# EAGLE schematic rn_mk2 (EAGLE 7.5.0)
Rusia Neagra MKII
TITLE: Rusia Neagra MKII

## Sheet 1 of 2: Rusia Neagra MKII main point to point
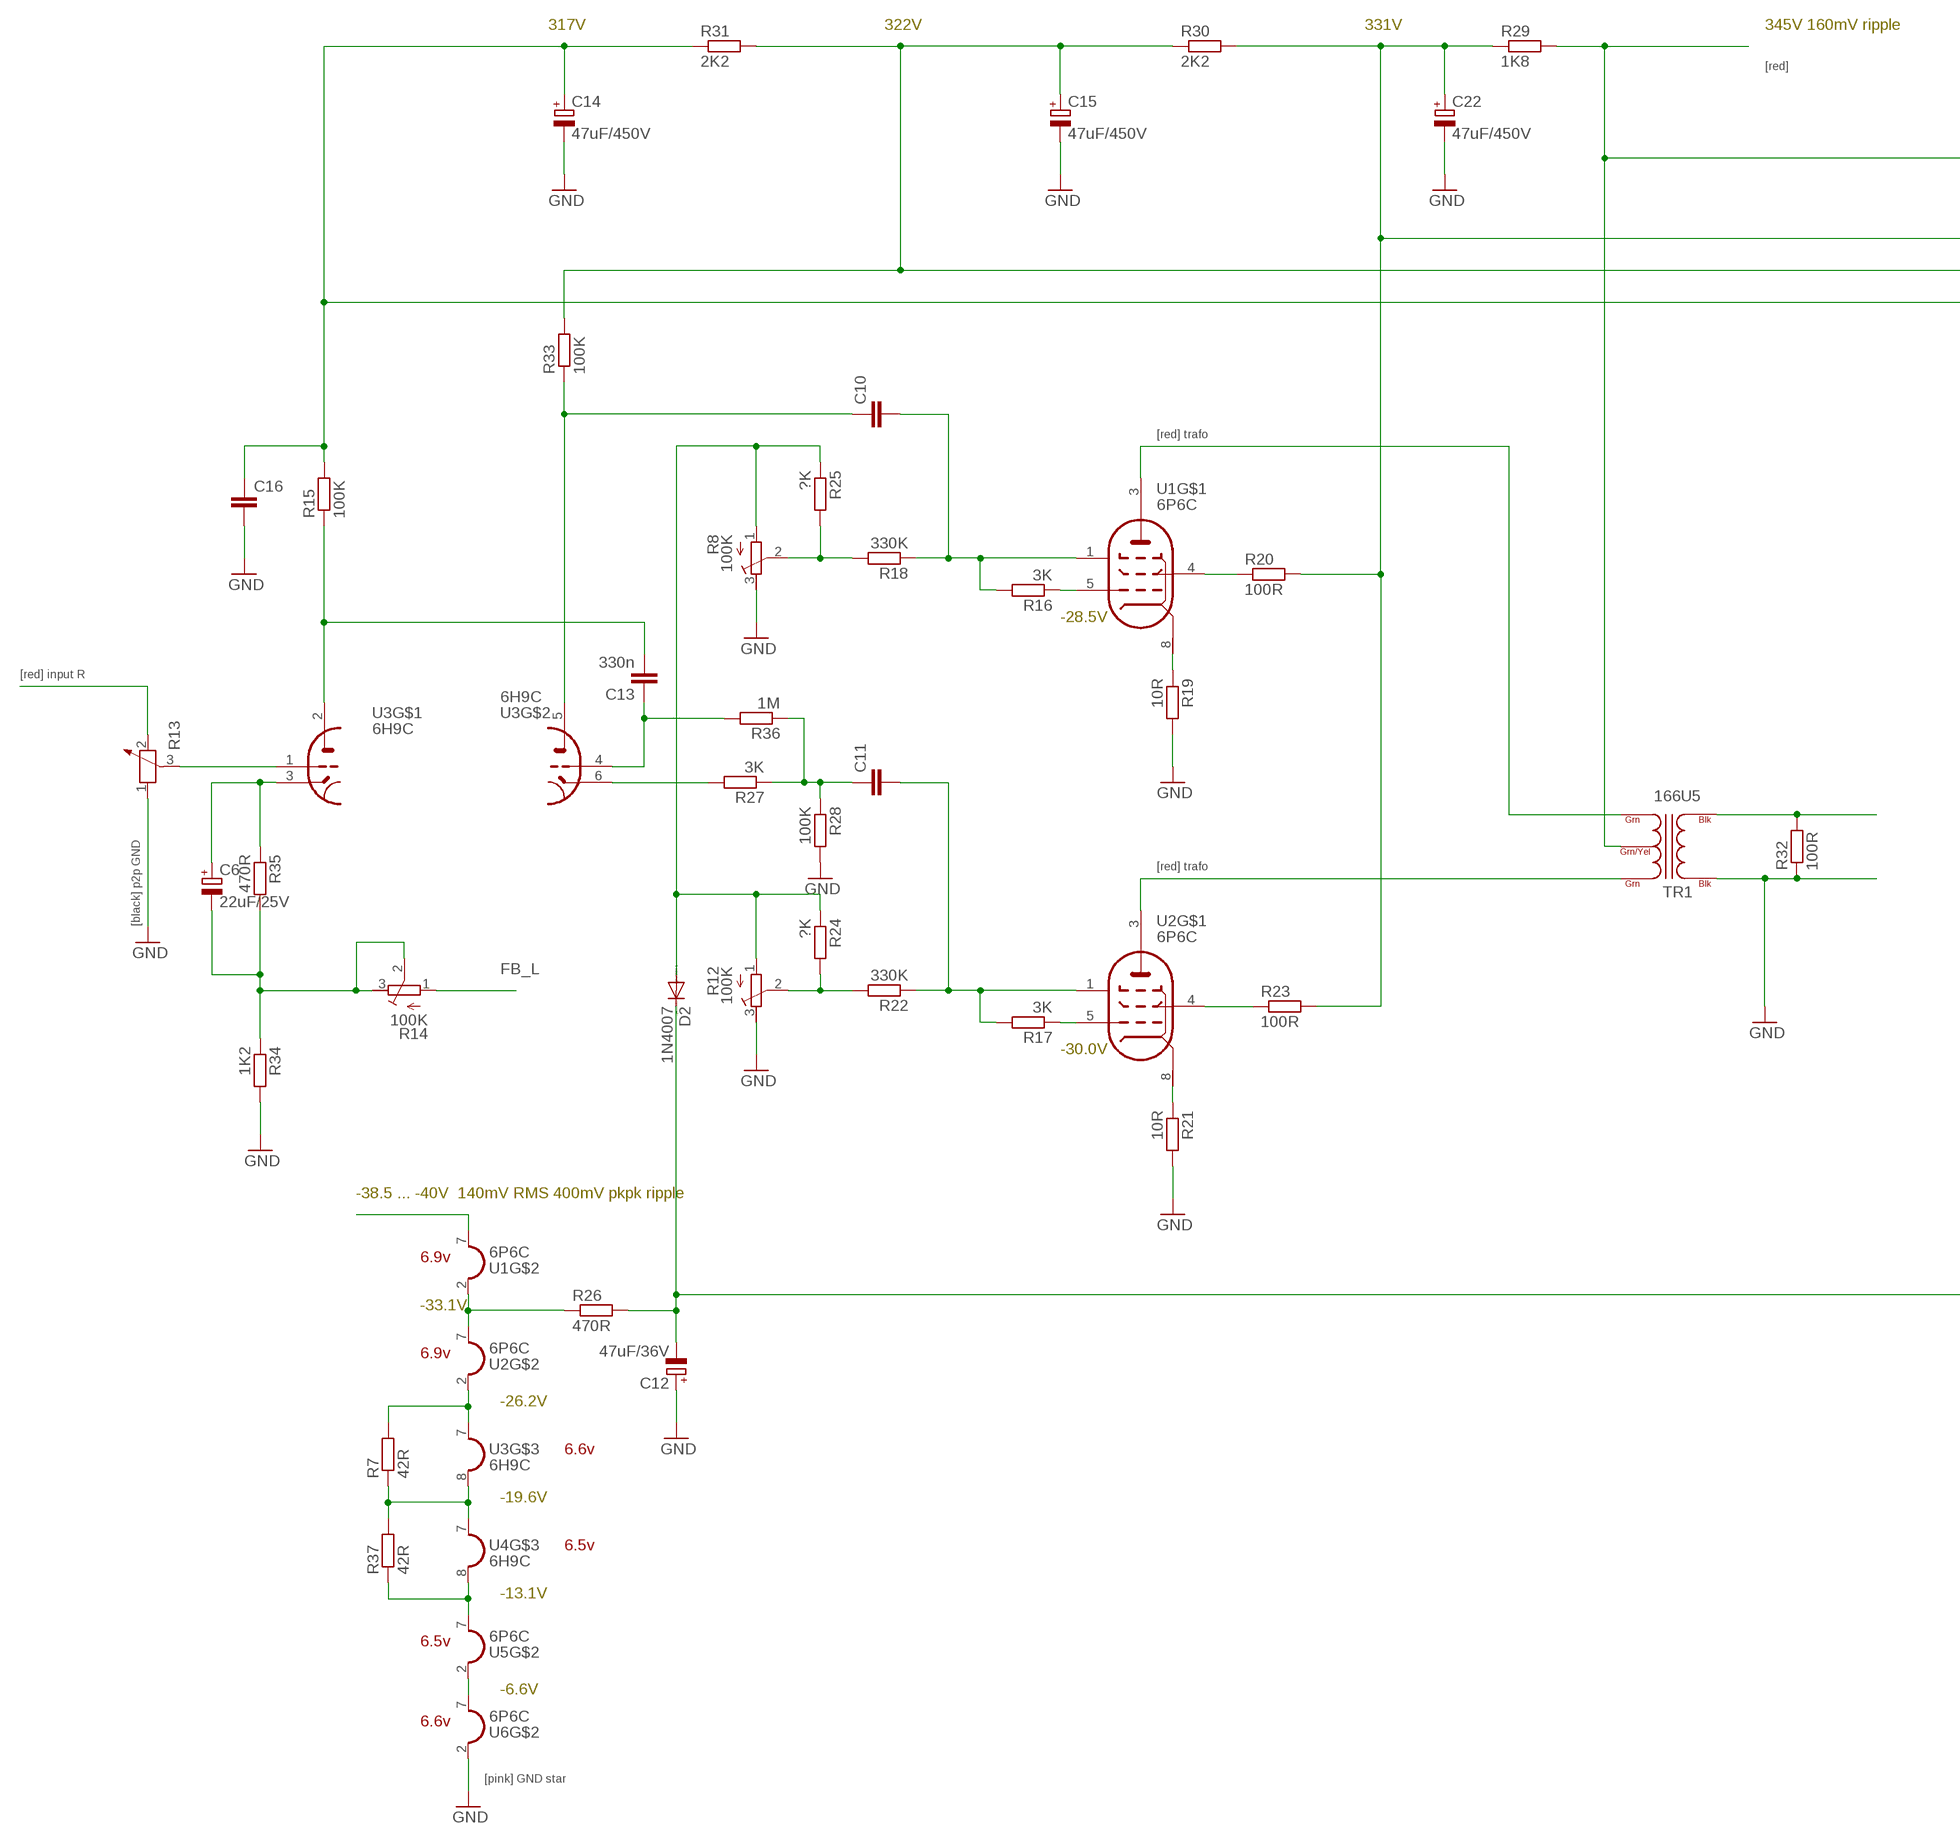
[diagram p0: schematic, sheet 1, part 1 of 2]
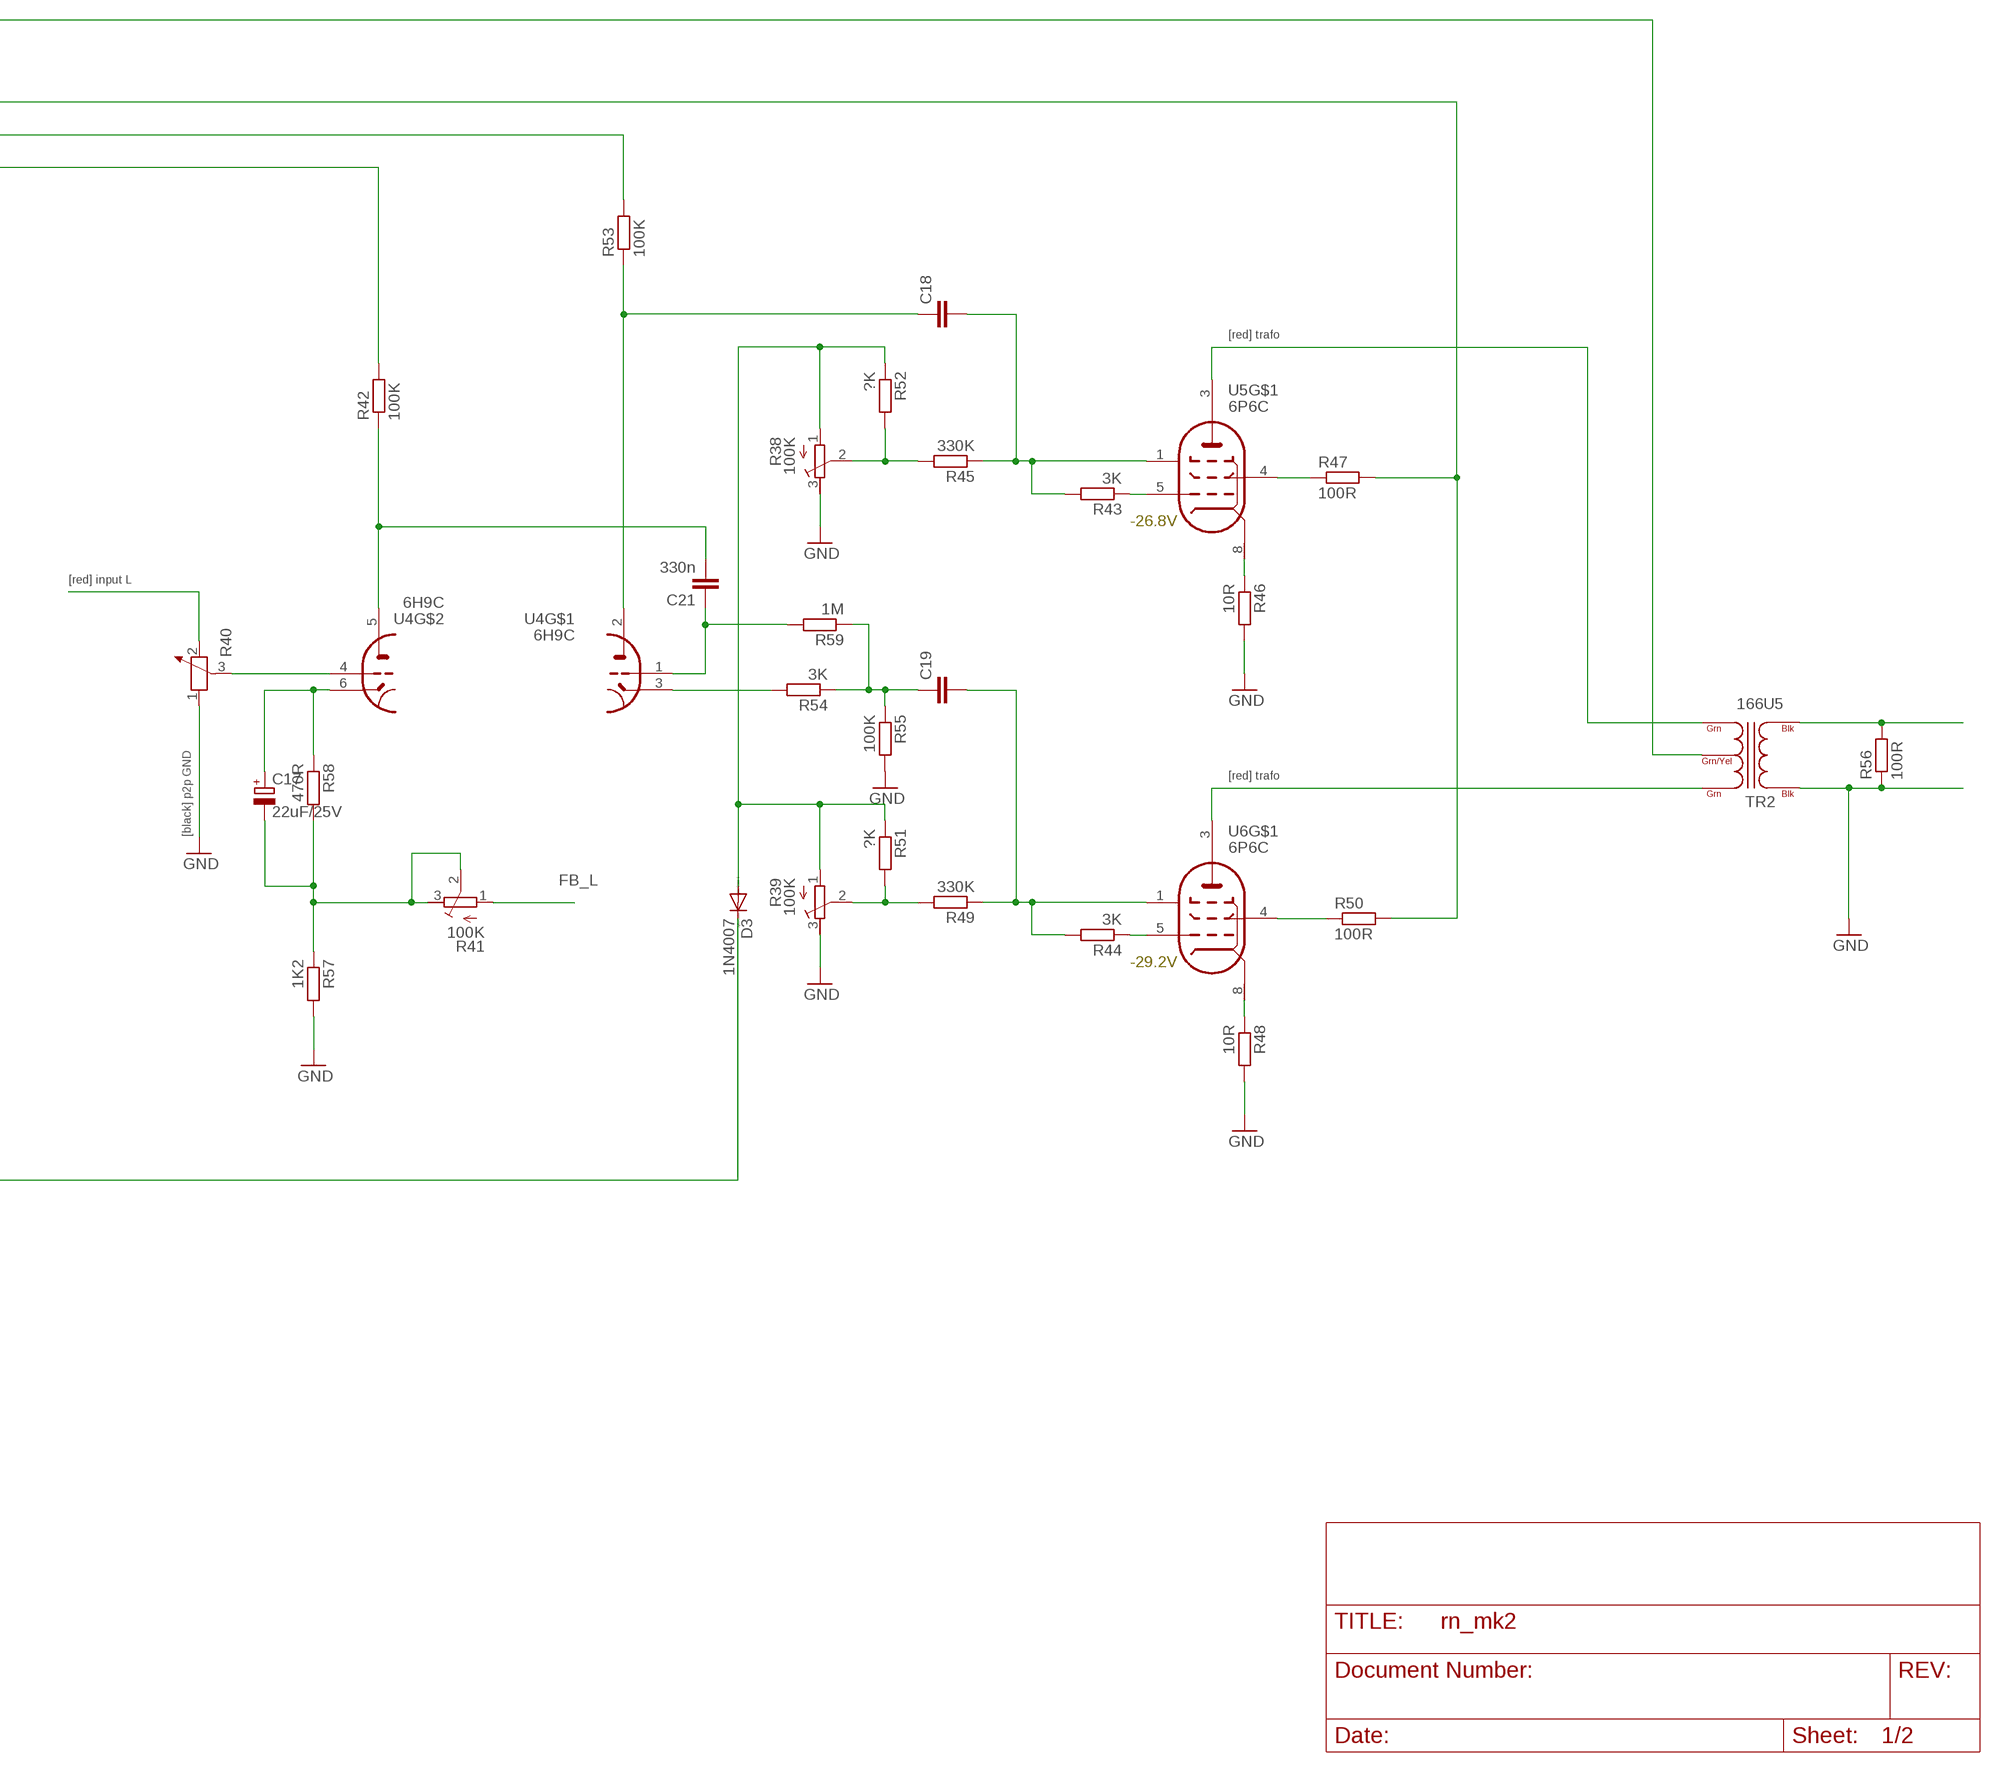
[diagram p1: schematic, sheet 1, part 2 of 2]

### Parts
C6  22uF/25V  CPOL-EUE5-5  [E5-5]
C10  C-EU150-054X183  [C150-054X183]
C11  C-EU150-054X183  [C150-054X183]
C12  47uF/36V  CPOL-EUE5-5  [E5-5]
C13  330n  C-EU150-054X183  [C150-054X183]
C14  47uF/450V  CPOL-EUE5-5  [E5-5]
C15  47uF/450V  CPOL-EUE5-5  [E5-5]
C16  C-EU150-054X183  [C150-054X183]
C17  22uF/25V  CPOL-EUE5-5  [E5-5]
C18  C-EU150-054X183  [C150-054X183]
C19  C-EU150-054X183  [C150-054X183]
C21  330n  C-EU150-054X183  [C150-054X183]
C22  47uF/450V  CPOL-EUE5-5  [E5-5]
D2  1N4007  1N4004  [DO41-10]
D3  1N4007  1N4004  [DO41-10]
R7  42R  R-EU_0414/15  [0414/15]
R8  100K  R-TRIMM64Y  [RTRIM64Y]
R12  100K  R-TRIMM64Y  [RTRIM64Y]
R13  POTENTIOMETER_PT-10  [PT-10]
R14  100K  R-TRIMM64Y  [RTRIM64Y]
R15  100K  R-EU_0414/15  [0414/15]
R16  3K  R-EU_0414/15  [0414/15]
R17  3K  R-EU_0414/15  [0414/15]
R18  330K  R-EU_0414/15  [0414/15]
R19  10R  R-EU_0414/15  [0414/15]
R20  100R  R-EU_0414/15  [0414/15]
R21  10R  R-EU_0414/15  [0414/15]
R22  330K  R-EU_0414/15  [0414/15]
R23  100R  R-EU_0414/15  [0414/15]
R24  ?K  R-EU_0414/15  [0414/15]
R25  ?K  R-EU_0414/15  [0414/15]
R26  470R  R-EU_0922/22  [0922/22]
R27  3K  R-EU_0414/15  [0414/15]
R28  100K  R-EU_0414/15  [0414/15]
R29  1K8  R-EU_0414/15  [0414/15]
R30  2K2  R-EU_0414/15  [0414/15]
R31  2K2  R-EU_0414/15  [0414/15]
R32  100R  R-EU_0414/15  [0414/15]
R33  100K  R-EU_0414/15  [0414/15]
R34  1K2  R-EU_0414/15  [0414/15]
R35  470R  R-EU_0414/15  [0414/15]
R36  1M  R-EU_0414/15  [0414/15]
R37  42R  R-EU_0414/15  [0414/15]
R38  100K  R-TRIMM64Y  [RTRIM64Y]
R39  100K  R-TRIMM64Y  [RTRIM64Y]
R40  POTENTIOMETER_PT-10  [PT-10]
R41  100K  R-TRIMM64Y  [RTRIM64Y]
R42  100K  R-EU_0414/15  [0414/15]
R43  3K  R-EU_0414/15  [0414/15]
R44  3K  R-EU_0414/15  [0414/15]
R45  330K  R-EU_0414/15  [0414/15]
R46  10R  R-EU_0414/15  [0414/15]
R47  100R  R-EU_0414/15  [0414/15]
R48  10R  R-EU_0414/15  [0414/15]
R49  330K  R-EU_0414/15  [0414/15]
R50  100R  R-EU_0414/15  [0414/15]
R51  ?K  R-EU_0414/15  [0414/15]
R52  ?K  R-EU_0414/15  [0414/15]
R53  100K  R-EU_0414/15  [0414/15]
R54  3K  R-EU_0414/15  [0414/15]
R55  100K  R-EU_0414/15  [0414/15]
R56  100R  R-EU_0414/15  [0414/15]
R57  1K2  R-EU_0414/15  [0414/15]
R58  470R  R-EU_0414/15  [0414/15]
R59  1M  R-EU_0414/15  [0414/15]
TR1  166U5  [C14H]
TR2  166U5  [C14H]
U1  6P6C  [OKTAL]
U2  6P6C  [OKTAL]
U3  6H9C  [OKTAL]
U4  6H9C  [OKTAL]
U5  6P6C  [OKTAL]
U6  6P6C  [OKTAL]

### Nets
FB_L: R14.1(A) R41.1(A)
GND: C12.+ C14.- C15.- C16.2 C22.- R8.3(E) R12.3(E) R13.1 R19.2 R21.2 R28.2 R32.1 R34.2 R38.3(E) R39.3(E) R40.1 R46.2 R48.2 R55.2 R56.1 R57.2 TR1.BLK@1(BLK) TR2.BLK@1(BLK) U6.2(H1)
N$11: U1.7(H2)
N$13: R26.1 U1.2(H1) U2.7(H2)
N$14: R7.2 U2.2(H1) U3.7(H1)
N$19: R7.1 R37.2 U3.8(H2) U4.7(H1)
N$20: R13.3 U3.1(TG1)
N$21: R16.1 U1.5(PG)
N$22: R13.2
N$23: C13.2 R15.1 U3.2(TA1)
N$24: C6.+ R35.1 U3.3(T1)
N$25: C13.1 R36.2 U3.4(TG2)
N$26: C10.2 R16.2 R18.1 U1.1(SH)
N$27: R17.1 U2.5(PG)
N$28: C11.2 R17.2 R22.1 U2.1(SH)
N$29: C10.1 R33.1 U3.5(TA2)
N$30: TR1.GRN@2(GRN) U1.3(PA)
N$31: R8.2(S) R18.2 R25.2
N$32: R19.1 U1.8(PK)
N$33: R20.1 U1.4(PSG)
N$34: D2.A R8.1(A) R12.1(A) R24.1 R25.1
N$35: TR1.GRN@1(GRN) U2.3(PA)
N$36: R21.1 U2.8(PK)
N$37: R12.2(S) R22.2 R24.2
N$38: C12.- D2.C D3.C R26.2
N$39: R23.1 U2.4(PSG)
N$40: R40.3 U4.4(TG2)
N$42: C11.1 R27.1 R28.1 R36.1
N$43: R27.2 U3.6(T2)
N$44: C15.+ R30.1 R31.2 R33.2 R53.2
N$45: U5.2(H1) U6.7(H2)
N$46: C22.+ R20.2 R23.2 R29.1 R30.2 R47.2 R50.2
N$47: C6.- R14.2(S) R14.3(E) R34.1 R35.2
N$48: C14.+ C16.1 R15.2 R31.1 R42.2
N$49: R32.2 TR1.BLK@2(BLK)
N$50: R37.1 U4.8(H2) U5.7(H2)
N$51: R54.2 U4.3(T1)
N$52: R40.2
N$53: C21.2 R42.1 U4.5(TA2)
N$54: C17.+ R58.1 U4.6(T2)
N$55: R43.1 U5.5(PG)
N$56: C18.2 R43.2 R45.1 U5.1(SH)
N$57: R44.1 U6.5(PG)
N$58: C19.2 R44.2 R49.1 U6.1(SH)
N$59: C18.1 R53.1 U4.2(TA1)
N$60: R46.1 U5.8(PK)
N$61: R47.1 U5.4(PSG)
N$62: D3.A R38.1(A) R39.1(A) R51.1 R52.1
N$63: R48.1 U6.8(PK)
N$64: R39.2(S) R49.2 R51.2
N$65: R50.1 U6.4(PSG)
N$66: R29.2 TR1.GRN/YEL TR2.GRN/YEL
N$67: R38.2(S) R45.2 R52.2
N$68: TR2.GRN@1(GRN) U6.3(PA)
N$69: TR2.GRN@2(GRN) U5.3(PA)
N$72: C19.1 R54.1 R55.1 R59.1
N$74: R56.2 TR2.BLK@2(BLK)
N$76: C17.- R41.2(S) R41.3(E) R57.1 R58.2
N$77: C21.1 R59.2 U4.1(TG1)

### Notes on the sheet
- 317V | 322V | 331V | 345V 160mV ripple
- [red]
- [red] trafo
- [red] trafo
- -28.5V
- -26.8V
- [red] input R
- [red] input L
- [red] trafo
- [red] trafo
- [black] p2p GND
- [black] p2p GND
- -30.0V
- -29.2V
- -38.5 ... -40V  140mV RMS 400mV pkpk ripple
- 6.9v
- -33.1V
- 6.9v
- -26.2V
- 6.6v
- -19.6V
- 6.5v
- -13.1V
- 6.5v
- -6.6V
- 6.6v
- [pink] GND star

## Sheet 2 of 2: Rusia Neagra MKII power pcb
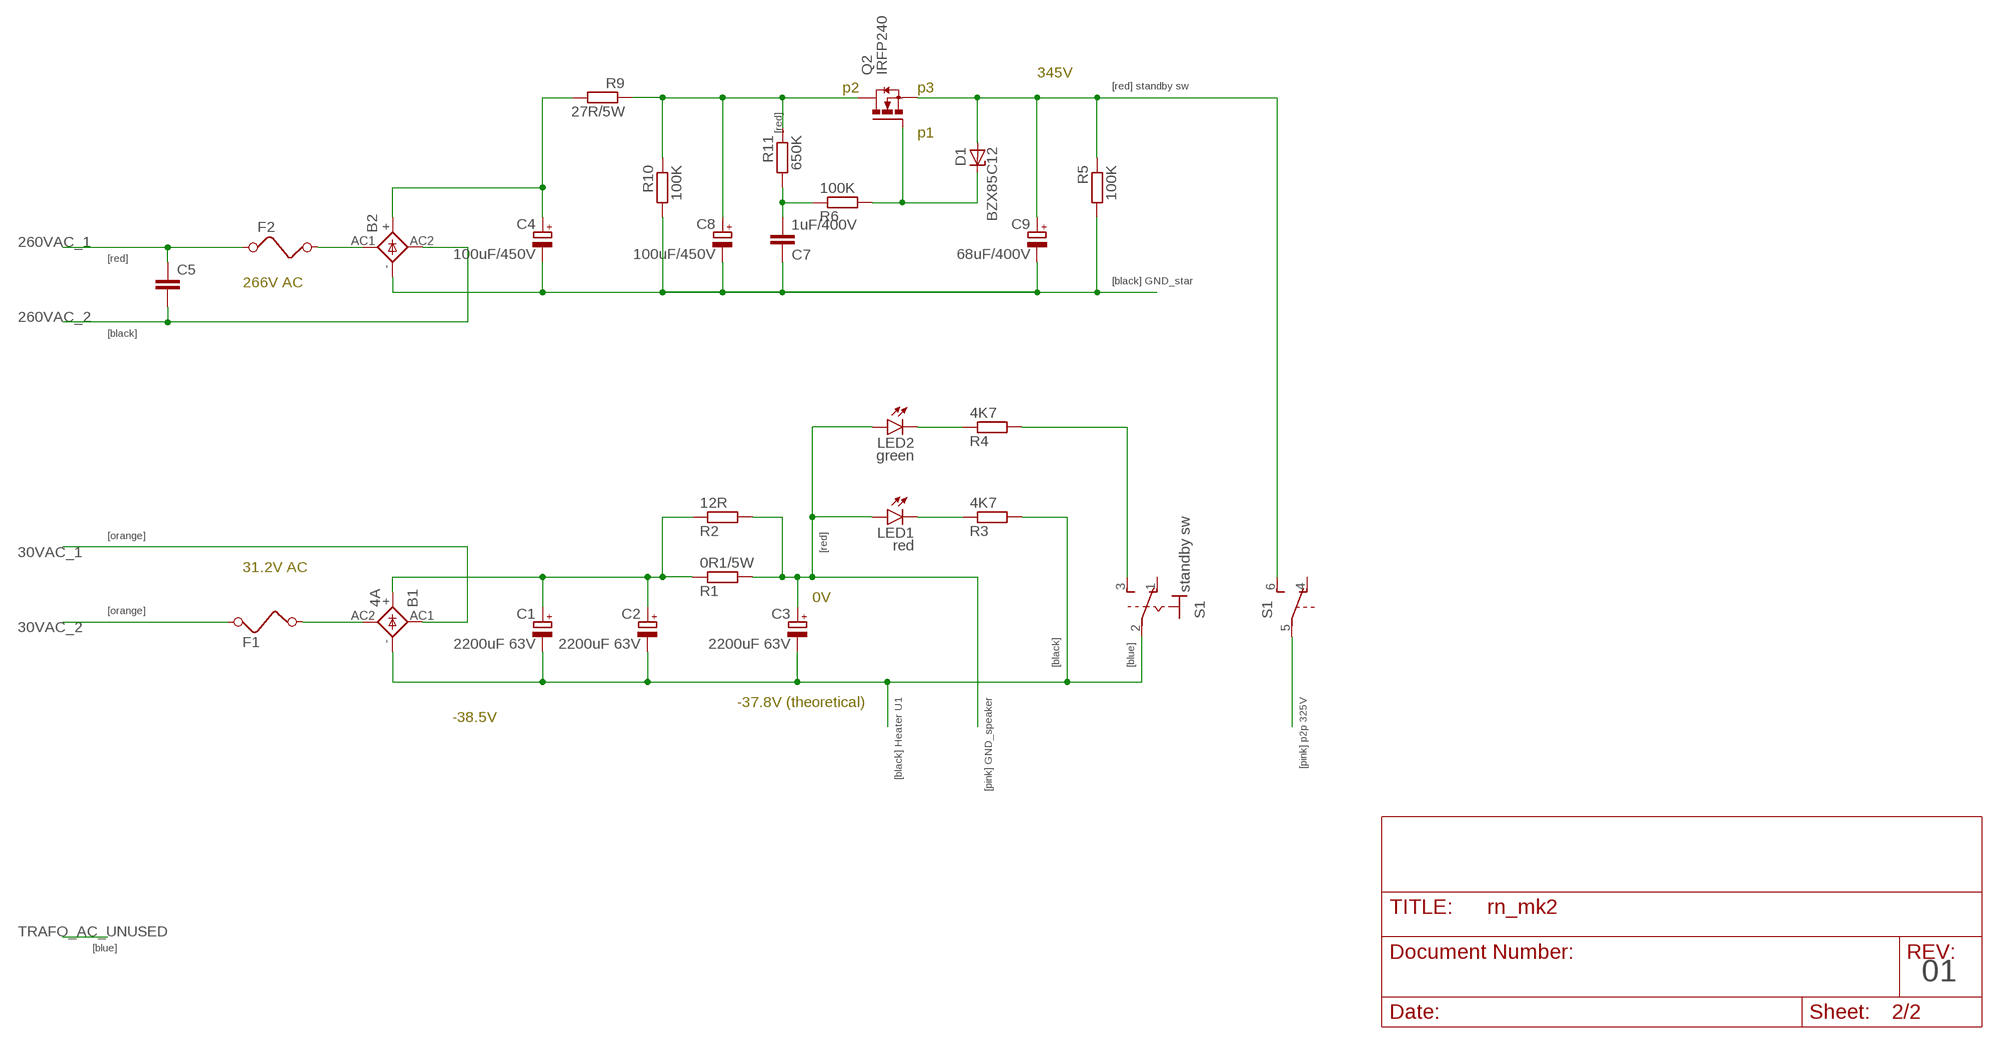
[diagram p2: schematic, sheet 2]

### Parts
B1  4A  DIOTEC_BC5000  [DIOTEC_BC5000]
B2  DIOTEC_BC5000  [DIOTEC_BC5000]
C1  2200uF 63V  CPOL-EUE7.5-18  [E7,5-18]
C2  2200uF 63V  CPOL-EUE7.5-18  [E7,5-18]
C3  2200uF 63V  CPOL-EUE7.5-18  [E7,5-18]
C4  100uF/450V  CPOL-EUE7.5-18  [E7,5-18]
C5  C-EU075-032X103  [C075-032X103]
C7  1uF/400V  C-EU075-032X103  [C075-032X103]
C8  100uF/450V  CPOL-EUE7.5-18  [E7,5-18]
C9  68uF/400V  CPOL-EUE7.5-18  [E7,5-18]
D1  BZX85C12  BZX85  [DO41Z10]
F1  FUSE  [FUSE]
F2  FUSE  [FUSE]
LED1  red  LED3MM  [LED3MM]
LED2  green  LED3MM  [LED3MM]
Q2  IRFP240  [TO247BV]
R1  0R1/5W  R-EU_0922/22  [0922/22]
R2  12R  R-EU_0922/22  [0922/22]
R3  4K7  R-EU_0922/22  [0922/22]
R4  4K7  R-EU_0922/22  [0922/22]
R5  100K  R-EU_0922/22  [0922/22]
R6  100K  R-EU_0922/22  [0922/22]
R9  27R/5W  R-EU_0922/22  [0922/22]
R10  100K  R-EU_0922/22  [0922/22]
R11  650K  R-EU_0922/22  [0922/22]
S1  standby sw  320-938  [320-938]

### Nets
30VAC_1: B1.AC1
30VAC_2: F1.1
260VAC_1: C5.1 F2.1
260VAC_2: B2.AC2 C5.2
N$1: B1.- C1.- C2.- C3.- R3.2 S1.2(1:P)
N$2: B1.AC2 F1.2
N$3: B1.+ C1.+ C2.+ R1.1 R2.1
N$4: C3.+ LED1.A LED2.A R1.2 R2.2
N$5: LED1.K(C) R3.1
N$6: LED2.K(C) R4.1
N$7: R4.2 S1.3(1:S)
N$8: B2.AC1 F2.2
N$9: B2.+ C4.+ R9.2
N$10: B2.- C4.- C7.1 C8.- C9.- R5.2 R10.2
N$12: S1.5(B:P)
N$15: C8.+ Q2.D R9.1 R10.1 R11.1
N$16: C7.2 R6.1 R11.2
N$17: D1.C Q2.G R6.2
N$18: C9.+ D1.A Q2.S R5.1 S1.6(B:S)
Unconnected: S1.1(1:O) S1.4(B:O)

### Notes on the sheet
- 345V
- p2 | p3 | [red] standby sw
- [red]
- p1
- [red]
- 266V AC | [black] GND_star
- [black]
- [orange] | [red]
- 31.2V AC
- 0V
- [orange]
- [black] | [blue]
- -37.8V (theoretical) | [black] Heater U1 | [pink] GND_speaker | [pink] p2p 325V
- -38.5V
- [blue]
- 01

## Library data of the parts
B1 B2 = Simplex-DiscreteSemi:DIOTEC_BC5000: DIOTEC RECTIFIER B..C5000-3000A, B..C5000-3300A grid 1 x 10, 2 x 7,5 mm
C1-C4 C6 C8 C9 C12 C14 C15 C17 C22 = rcl:CPOL-EU: POLARIZED CAPACITOR, European symbol
C5 C7 C10 C11 C13 C16 C18 C19 C21 = rcl:C-EU: CAPACITOR, European symbol
D1 = diode:BZX85: Z DIODE
D2 D3 = diode:1N4004: DIODE general purpose rectifier, 1 A
F1 F2 = special:FUSE: FUSE 5 x 20 mm
LED1 LED2 = SparkFun-LED:LED: LEDs Standard schematic elements and footprints for 5mm, 3mm, 1206, and 0603 sized LEDs. 5mm - Spark Fun Electronics SKU : COM-00529 (and others)
Q2 = transistor-power:IRFP240: HEXFET Power MosFet Source: http://www.irf.com/
R1-R7 R9-R11 R15-R37 R42-R59 = rcl:R-EU_: RESISTOR, European symbol
R8 R12 R14 R38 R39 R41 = rcl:R-TRIMM: Trimm resistor
R13 R40 = rcl:POTENTIOMETER_: Potentiometer
S1 = switch:320-938: TOGGLE SWITCH distributor RS Components
TR1 TR2 = trafo-hammondmfg:166: OPEN STYLE FILAMENT & L.V. RECTIFIER USE TRANSFORMERS Economical single primnary 115VAC, 60 Hz or 117 VAC 50/60 Hz Source: Data sheet <http://www.hammondmfg.com/166.htm>
U1 U2 U5 U6 = Tubes:6P6C: 6P6C 6П6С 6V6GT 6V6
U3 U4 = Tubes:6H9C: 6H9C

## Net classes
1 vcc: width 0.203 mm